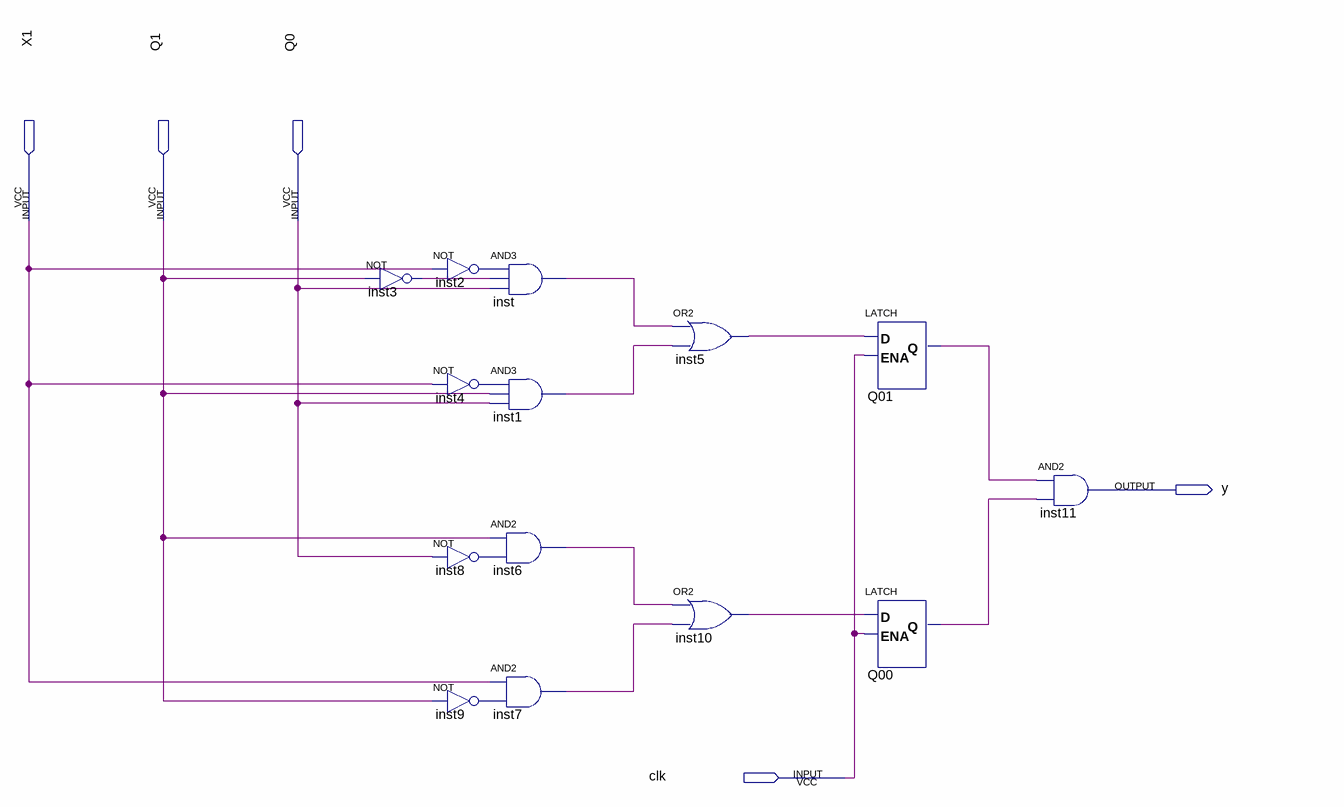
[diagram p0: schematic sheet]
// Quartus schematic M3F3.bdf as structural Verilog: 14 symbols, 5 pins
module M3F3 (
  input  X1,
  input  Q1,
  input  Q0,
  input  clk,
  output y
);

  wire inst1_out, inst2_out, inst3_out, inst4_out, inst5_out, inst6_out, inst7_out, inst8_out, inst9_out,
       inst10_out, inst_out, Q00_q, Q01_q;

  not inst3 (inst3_out, Q1);
  not inst2 (inst2_out, X1);
  not inst4 (inst4_out, X1);
  not inst8 (inst8_out, Q0);
  not inst9 (inst9_out, Q1);
  and inst (inst_out, inst2_out, inst3_out, Q0);
  and inst1 (inst1_out, inst4_out, Q1, Q0);
  and inst6 (inst6_out, Q1, inst8_out);
  and inst7 (inst7_out, X1, inst9_out);
  or inst5 (inst5_out, inst_out, inst1_out);
  or inst10 (inst10_out, inst6_out, inst7_out);
  LATCH Q01 (.D(inst5_out), .ENA(clk), .Q(Q01_q));
  LATCH Q00 (.D(inst10_out), .ENA(clk), .Q(Q00_q));
  and inst11 (y, Q01_q, Q00_q);
endmodule
